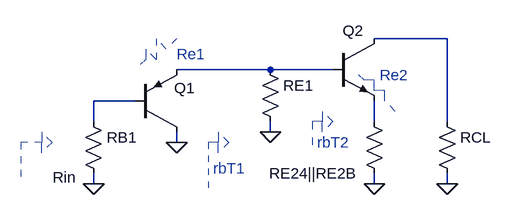
[diagram p0: schematic resistencia_de_entrada.asc]
resistencia_de_entrada.asc, the LTspice schematic file:
Version 4
SHEET 1 880 680
WIRE 560 96 448 96
WIRE 288 144 144 144
WIRE 384 144 288 144
WIRE 80 192 16 192
WIRE 16 224 16 192
WIRE 448 224 448 192
WIRE 560 224 560 96
WIRE 288 240 288 224
WIRE 144 256 144 240
WIRE 16 320 16 304
WIRE 448 320 448 304
WIRE 560 320 560 304
FLAG 16 320 0
FLAG 144 256 0
FLAG 288 240 0
FLAG 448 320 0
FLAG 560 320 0
SYMBOL pnp 80 240 M180
WINDOW 0 60 68 Left 2
SYMATTR InstName Q1
SYMATTR Value ""
SYMBOL npn 384 96 R0
WINDOW 0 15 -12 Left 2
SYMATTR InstName Q2
SYMATTR Value ""
SYMBOL res 0 208 R0
WINDOW 3 -47 102 Left 2
SYMATTR InstName RB1
SYMATTR Value Rin
SYMBOL res 272 128 R0
SYMATTR InstName RE1
SYMATTR Value ""
SYMBOL res 432 208 R0
WINDOW 0 -146 96 Left 2
SYMATTR InstName RE24||RE2B
SYMATTR Value ""
SYMBOL res 544 208 R0
SYMATTR InstName RCL
SYMATTR Value ""
TEXT 200 296 Left 2 ;rbT1
TEXT 360 256 Left 2 ;rbT2
TEXT 144 120 Left 2 ;Re1
TEXT 456 152 Left 2 ;Re2
LINE Normal -96 256 -96 320 2
LINE Normal -64 256 -96 256 2
LINE Normal -64 240 -64 256 2
LINE Normal -48 256 -64 240 2
LINE Normal -64 272 -64 256 2
LINE Normal -48 256 -64 272 2
LINE Normal 192 256 192 336 2
LINE Normal 208 256 192 256 2
LINE Normal 208 240 208 256 2
LINE Normal 224 256 208 240 2
LINE Normal 208 272 208 256 2
LINE Normal 224 256 208 272 2
LINE Normal 352 224 352 272 2
LINE Normal 368 224 352 224 2
LINE Normal 368 208 368 224 2
LINE Normal 384 224 368 208 2
LINE Normal 368 240 368 224 2
LINE Normal 384 224 368 240 2
LINE Normal 96 128 80 144 2
LINE Normal 96 112 96 128 2
LINE Normal 112 128 96 112 2
LINE Normal 112 96 112 128 2
LINE Normal 128 112 112 96 2
LINE Normal 144 96 128 112 2
LINE Normal 432 160 416 144 2
LINE Normal 448 160 432 160 2
LINE Normal 448 176 448 160 2
LINE Normal 464 176 448 176 2
LINE Normal 464 192 464 176 2
LINE Normal 480 208 464 192 2

The netlist it stands for:
* resistencia_de_entrada.asc
Q1 0 N003 N002 0
Q2 N001 N002 N004 0
RB1 N003 0 Rin
RE1 N002 0
RE24||RE2B N004 0
RCL N001 0
.model NPN NPN
.model PNP PNP
.lib standard.bjt
* rbT1
* rbT2
* Re1
* Re2
.backanno
.end